# EAGLE schematic pineapple_2_2013_model_0 (EAGLE 6.2)
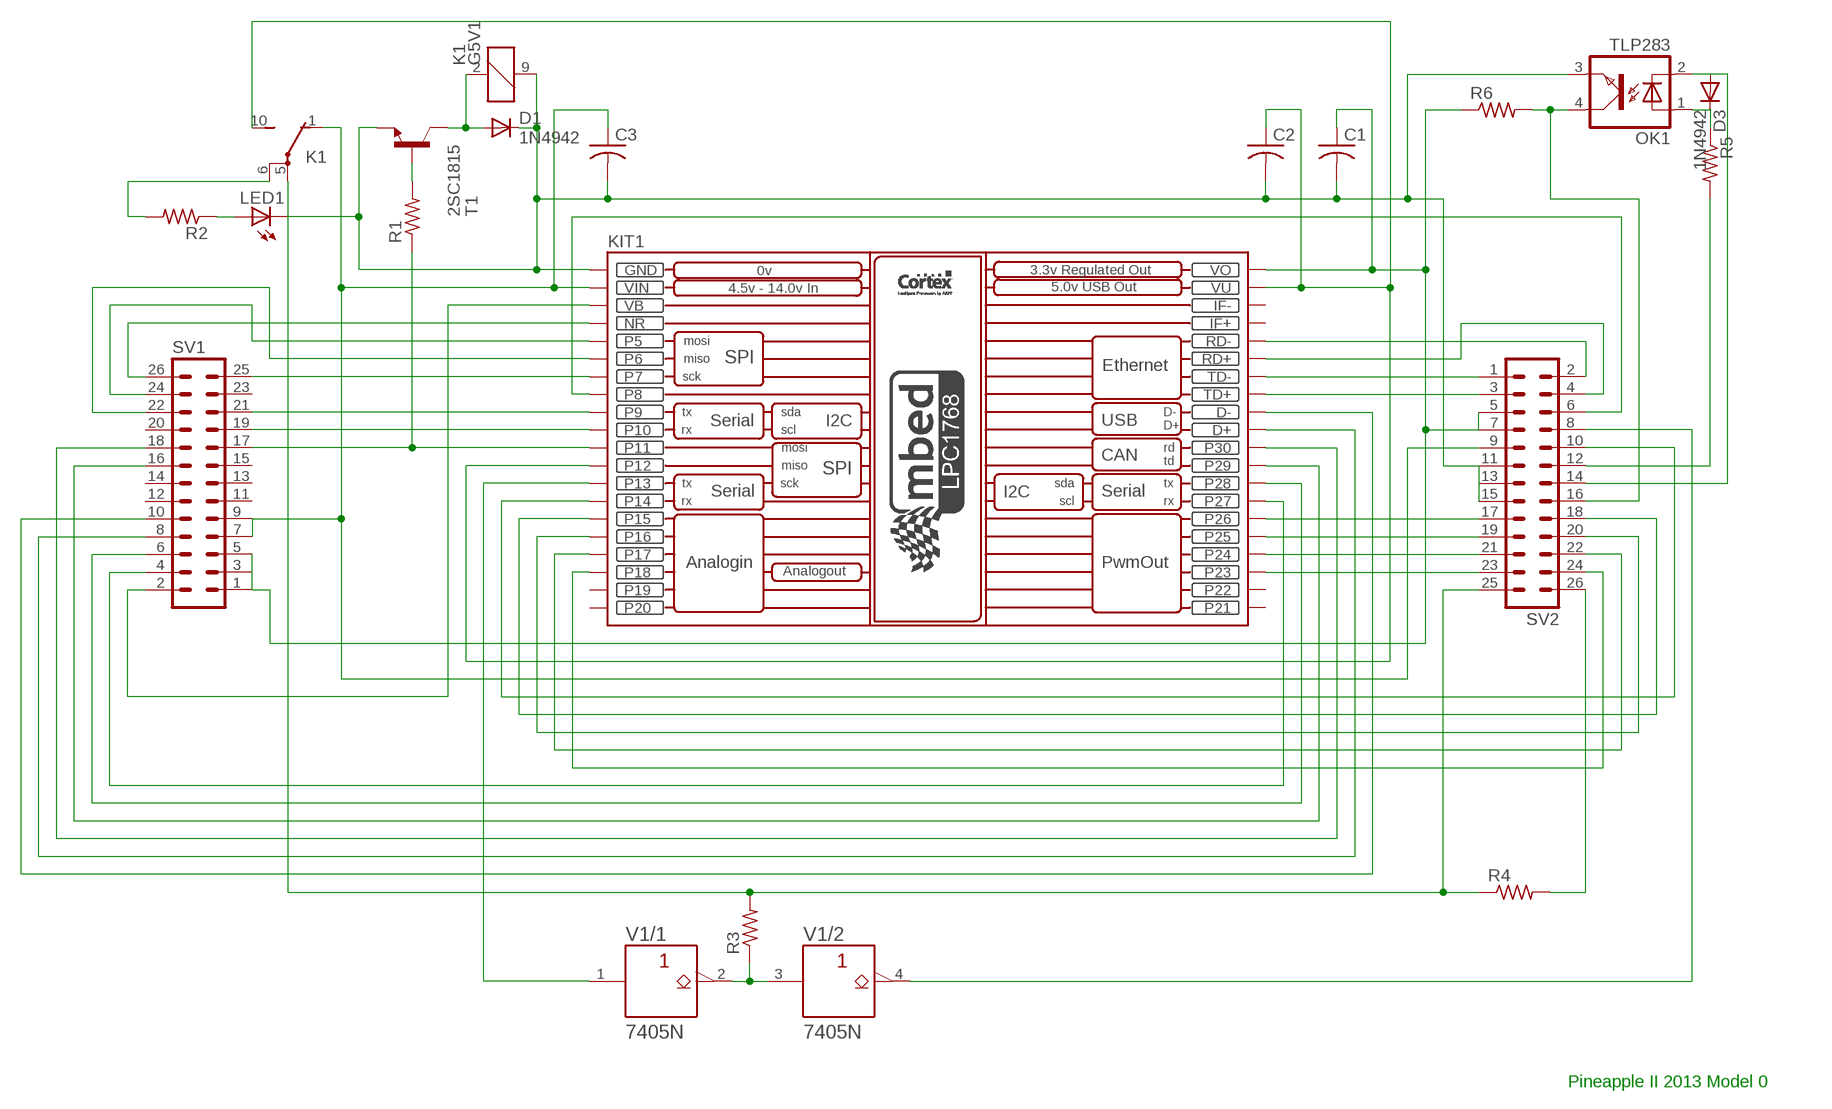
[diagram p0: schematic, sheet 1]

## Parts
C1  C-US025-024X044  [C025-024X044]
C2  C-US025-024X044  [C025-024X044]
C3  C-US050-024X044  [C050-024X044]
D1  1N4942  [DO41-10]
D3  1N4942  [DO41-10]
K1  G5V1  [G5V1]
KIT1  MBED_NXP_LPC1768  [MBED-KIT]
LED1  LED3MM  [LED3MM]
OK1  TLP283  [MINI-FLAT-4]
R1  R-US_0204/5  [0204/5]
R2  R-US_0204/5  [0204/5]
R3  R-US_0204/5  [0204/5]
R4  R-US_0204/5  [0204/5]
R5  R-US_0204/5  [0204/5]
R6  R-US_0204/5  [0204/5]
SV1  ML26L  [ML26L]
SV2  ML26L  [ML26L]
T1  2SC1815  [TO92-ECB]
V1  7405N  [DIL14]

## Nets
N$1: C2.1 K1.10(2:S) KIT1.P$12(P12) KIT1.VU
N$2: KIT1.P$25(P25) SV2.19
N$3: D3.C OK1.1(A) R5.1
N$4: KIT1.P$23(P23) SV2.23
N$5: KIT1.P$5(P5) SV1.24
N$6: R1.2 T1.B
N$7: KIT1.VB SV1.2
N$8: KIT1.NR SV1.26
N$9: KIT1.P$6(P6) SV1.22
N$10: KIT1.P$7(P7) SV1.25
N$11: KIT1.P$8(P8) SV2.6
N$12: KIT1.P$9(P9) SV1.21
N$13: KIT1.P$10(P10) SV1.19
N$14: KIT1.P$11(P11) R1.1 SV1.17
N$15: D1.A K1.2 T1.C
N$16: C1.2 C2.2 C3.2 D1.C K1.9 KIT1.GND LED1.K(C) OK1.3(EMIT) SV2.11 SV2.13 SV2.15 T1.E
N$17: R3.1 V1.2(/1:Y) V1.3(/2:A)
N$18: KIT1.P$13(P13) V1.1(/1:A)
N$19: LED1.A R2.1
N$20: K1.6(2:P) R2.2
N$21: K1.5(2:P) R3.2 R4.1 SV2.25
N$22: SV2.8 V1.4(/2:Y)
N$23: KIT1.P$14(P14) SV2.10
N$24: KIT1.P$15(P15) SV2.18
N$25: KIT1.P$24(P24) SV2.21
N$26: KIT1.P$16(P16) SV2.20
N$27: C3.1 K1.1(2:O) KIT1.VIN SV1.7 SV1.9 SV2.9
N$28: KIT1.P$18(P18) SV2.24
N$30: KIT1.P$26(P26) SV2.17
N$31: KIT1.P$27(P27) SV1.4
N$32: KIT1.P$28(P28) SV1.6
N$33: KIT1.P$29(P29) SV1.16
N$34: KIT1.P$30(P30) SV1.18
N$35: KIT1.D+ SV1.8
N$36: KIT1.D- SV1.10
N$37: R5.2 SV2.12
N$38: KIT1.TD+ SV2.3
N$39: KIT1.TD- SV2.1
N$40: KIT1.RD+ SV2.4
N$41: KIT1.RD- SV2.2
N$42: R4.2 SV2.26
N$43: D3.A OK1.2(C) SV2.14
N$44: C1.1 KIT1.VOUT(VO) R6.1 SV1.1 SV1.3 SV1.5 SV2.5 SV2.7
N$45: OK1.4(COL) R6.2 SV2.16
N$46: KIT1.P$17(P17) SV2.22
Unconnected: KIT1.IF+ KIT1.IF- KIT1.P$19(P19) KIT1.P$20(P20) KIT1.P$21(P21) KIT1.P$22(P22) SV1.11 SV1.12 SV1.13 SV1.14 SV1.15 SV1.20 SV1.23 V1.5(/3:A) V1.6(/3:Y) V1.8(/4:Y) V1.9(/4:A) V1.10(/5:Y) V1.11(/5:A) V1.12(/6:Y) V1.13(/6:A)

## Notes on the sheet
- Pineapple II 2013 Model 0

## Power pins joined to a net without a drawn wire
+UB: V1.14(/+UB:+UB)
-UB: V1.7(/-UB:-UB)

## Library data of the parts
C1-C3 = resistor:C-US: CAPACITOR, American symbol
D1 D3 = diode:1N4942: DIODE 1.0 A, 200 V, 150 ns
K1 = relay:G5V1: RELAY 1 x switch, 0.5 A/125 V AC, 1 A/24 V DC , Omron; MPN: G5V-1-DC24; OC_FARNELL: 9949593; OC_NEWARK: 36M6377
KIT1 = MBED_v2.1:MBED_NXP_LPC1768: Mbed LPC1768 - ARM CORTEX v2.1 * Schematic symbol is now placed in eagles's default raster. *The pads diameter are suitable for routing between mbed pins * mbed pads are 0.8 mm drill diameter. --------------------------------------------- Created by: Mohamed Yousry *Alexandria, Egypt *Email: mohamed.yousry@ieeegoldegypt.org
LED1 = led:LED: LED OSRAM: - CHIPLED LG R971, LG N971, LY N971, LG Q971, LY Q971, LO R971, LY R971 LH N974, LH R974 LS Q976, LO Q976, LY Q976 LO Q996 - Hyper CHIPLED LW Q18S LB Q993, LB Q99A, LB R99A - SideLED LS A670, LO A670, LY A670, LG A670, LP A670 LB A673, LV A673, LT A673, LW A673 LH A674 LY A675 LS A676, LA A676, LO A676, LY A676, LW A676 LS A679, LY A679, LG A679 - Hyper Micro SIDELED® LS Y876, LA Y876, LO Y876, LY Y876 LT Y87S - SmartLED LW L88C, LW L88S LB L89C, LB L89S, LG L890 LS L89K, LO L89K, LY L89K LS L896, LA L896, LO L896, LY L896 - TOPLED LS T670, LO T670, LY T670, LG T670, LP T670 LSG T670, LSP T670, LSY T670, LOP T670, LYG T670 LG T671, LOG T671, LSG T671 LB T673, LV T673, LT T673, LW T673 LH T674 LS T676, LA T676, LO T676, LY T676, LB T676, LH T676, LSB T676, LW T676 LB T67C, LV T67C, LT T67C, LS T67K, LO T67K, LY T67K, LW E67C LS E67B, LA E67B, LO E67B, LY E67B, LB E67C, LV E67C, LT E67C LW T67C LS T679, LY T679, LG T679 LS T770, LO T770, LY T770, LG T770, LP T770 LB T773, LV T773, LT T773, LW T773 LH T774 LS E675, LA E675, LY E675, LS T675 LS T776, LA T776, LO T776, LY T776, LB T776 LHGB T686 LT T68C, LB T68C - Hyper Mini TOPLED® LB M676 - Mini TOPLED Santana® LG M470 LS M47K, LO M47K, LY M47K Source: http://www.osram.convergy.de LUXEON: - LUMILED® LXK2-PW12-R00, LXK2-PW12-S00, LXK2-PW14-U00, LXK2-PW14-V00 LXK2-PM12-R00, LXK2-PM12-S00, LXK2-PM14-U00 LXK2-PE12-Q00, LXK2-PE12-R00, LXK2-PE12-S00, LXK2-PE14-T00, LXK2-PE14-U00 LXK2-PB12-K00, LXK2-PB12-L00, LXK2-PB12-M00, LXK2-PB14-N00, LXK2-PB14-P00, LXK2-PB14-Q00 LXK2-PR12-L00, LXK2-PR12-M00, LXK2-PR14-Q00, LXK2-PR14-R00 LXK2-PD12-Q00, LXK2-PD12-R00, LXK2-PD12-S00 LXK2-PH12-R00, LXK2-PH12-S00 LXK2-PL12-P00, LXK2-PL12-Q00, LXK2-PL12-R00 Source: www.luxeon.com KINGBRIGHT: KA-3528ASYC Source: www.kingbright.com
OK1 = optocoupler:TLP283: TOSHIBA PHOTOCOUPLER GaAs IRED & PHOTO-TRANSISTOR Source: http://www.semicon.toshiba.co.jp/td/en/Opto/Photocoupler/en_20050928_TLP283_datasheet.pdf; OC_FARNELL: unknown; OC_NEWARK: unknown
R1-R6 = resistor:R-US_: RESISTOR, American symbol
SV1 SV2 = con-ml:ML26L: HARTING; OC_FARNELL: unknown; OC_NEWARK: unknown
T1 = transistor:2SC1815: NPN EPITAXIAL TRANSISTOR Source: TOSHIBA .. 2SC1815 1.pdf
V1 = 74ttl-din:74*05: Hex INVERTER, open collector